# EAGLE design 311_lora (EAGLE 8.2.2)
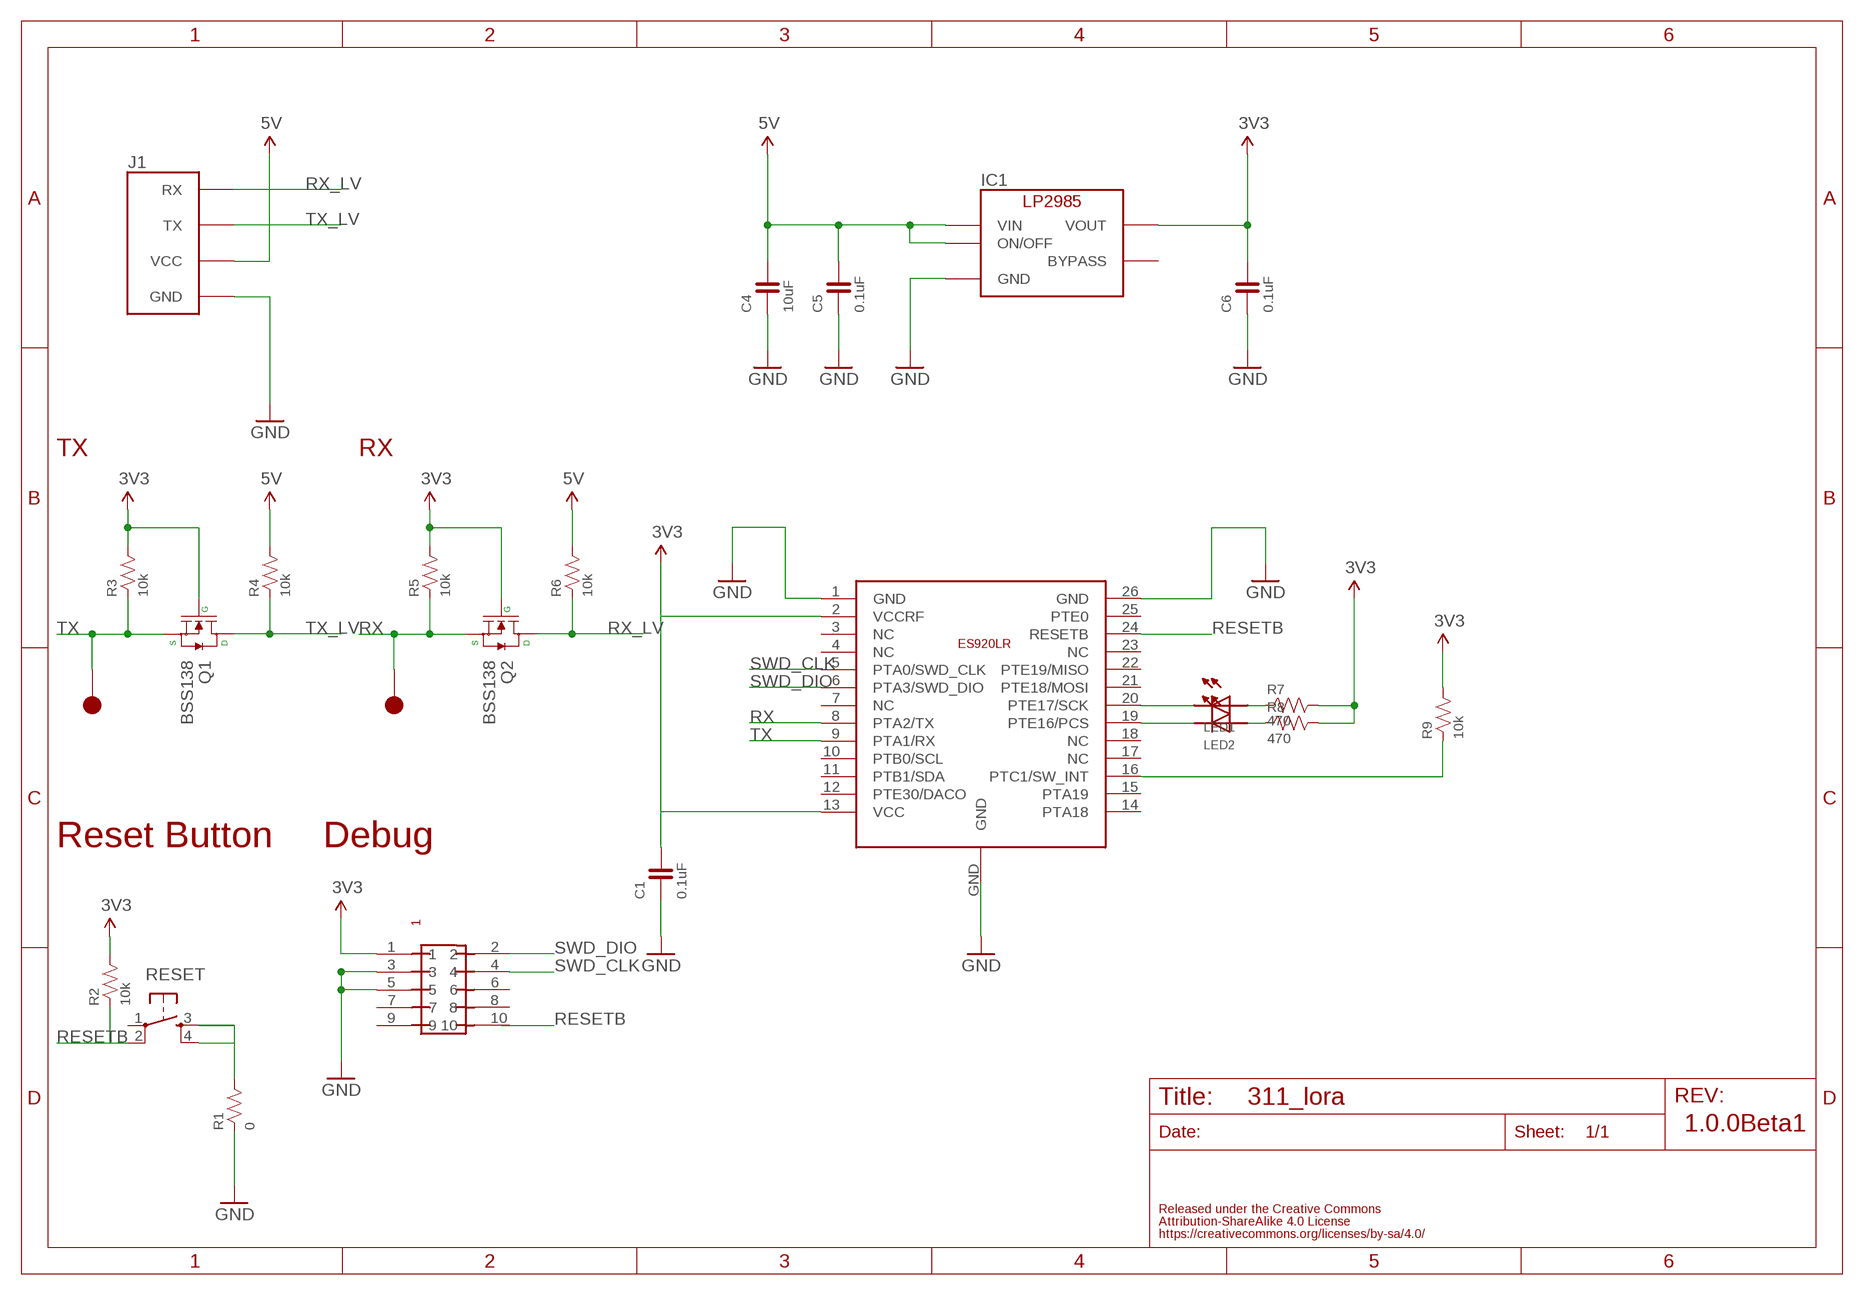
[diagram p0: schematic, sheet 1]

## Parts
C1  0.1uF  CAPACITOR-0603_NARROW  [0603-NARROW]
C4  10uF  CAPACITOR-0603_NARROW  [0603-NARROW]
C5  0.1uF  CAPACITOR-0603_NARROW  [0603-NARROW]
C6  0.1uF  CAPACITOR-0603_NARROW  [0603-NARROW]
IC1  LP2985-33DBV  [SOT-23-5]
J1  FABO_BRICK_SERIAL-LONGER  [FABO_BRICK_SERIAL_LONGER]
LED1  LED-0603  [0603]
LED2  LED-0603  [0603]
Q1  BSS138  MOSFET-N  [SOT23-3]
Q2  BSS138  MOSFET-N  [SOT23-3]
R1  0  RESISTOR-0603-NARROW  [0603-NARROW]
R2  10k  RESISTOR-0603-NARROW  [0603-NARROW]
R3  10k  RESISTOR-0603-NARROW  [0603-NARROW]
R4  10k  RESISTOR-0603-NARROW  [0603-NARROW]
R5  10k  RESISTOR-0603-NARROW  [0603-NARROW]
R6  10k  RESISTOR-0603-NARROW  [0603-NARROW]
R7  470  RESISTOR-0603-NARROW  [0603-NARROW]
R8  470  RESISTOR-0603-NARROW  [0603-NARROW]
R9  10k  RESISTOR-0603-NARROW  [0603-NARROW]
RESET  TACT-SWITCH-SMD_KMR2  [KMR2]
TP10  TP-15  [TP-15]
TP11  TP-15  [TP-15]
U$2  ES920LR  [ES920LR]
U$8  PIN-HEADER-SMT(1.27MM)2X5  [PIN-HEADER-SMT(1.27MM)2X5]

## Nets
3V3: C1.2 C6.2 IC1.5(VOUT) Q1.1(G) Q2.1(G) R2.2 R3.2 R5.2 R7.2 R8.2 R9.2 U$2.2(VCCRF) U$2.13(VCC) U$8.1
5V: C4.2 C5.2 IC1.1(VIN) IC1.3(ON/OFF) J1.VCC R4.2 R6.2
GND: C1.1 C4.1 C5.1 C6.1 IC1.2(GND) J1.GND R1.1 U$2.1(GND) U$2.26(GND) U$2.GND U$8.3 U$8.5
N$2: R1.2 RESET.3 RESET.4
N$3: LED2.CATHODE U$2.19(PTE16/PCS)
N$4: LED1.CATHODE U$2.20(PTE17/SCK)
N$5: LED1.ANODE R7.1
N$6: LED2.ANODE R8.1
N$7: R9.1 U$2.16(PTC1/SW_INT)
RESETB: R2.1 RESET.2 U$2.24(RESETB) U$8.10
RX: Q2.2(S) R5.1 TP10.1 U$2.8(PTA2/TX)
RX_LV: J1.RX Q2.3(D) R6.1
SWD_CLK: U$2.5(PTA0/SWD_CLK) U$8.4
SWD_DIO: U$2.6(PTA3/SWD_DIO) U$8.2
TX: Q1.2(S) R3.1 TP11.1 U$2.9(PTA1/RX)
TX_LV: J1.TX Q1.3(D) R4.1
Unconnected: IC1.4(BYPASS) RESET.1 U$2.3(NC) U$2.4(NC) U$2.7(NC) U$2.10(PTB0/SCL) U$2.11(PTB1/SDA) U$2.12(PTE30/DACO) U$2.14(PTA18) U$2.15(PTA19) U$2.17(NC) U$2.18(NC) U$2.21(PTE18/MOSI) U$2.22(PTE19/MISO) U$2.23(NC) U$2.25(PTE0) U$8.6 U$8.7 U$8.8 U$8.9

## Notes on the sheet
- TX | RX
- Reset Button | Debug
- 1.0.0Beta1

## Library data of the parts
C1 C4-C6 = FaBo-Capacitor:CAPACITOR: CAPACITOR
IC1 = FaBo-Supply:LP2985: LP2985
J1 = FaBo-Template:FABO_BRICK_SERIAL: FaBo Brick Serial
LED1 LED2 = FaBo-LED:LED
Q1 Q2 = FaBo-etc:MOSFET-N
R1-R9 = FaBo-Resistors:RESISTOR: RESISTOR
RESET = FaBo-Switch:TACT-SWITCH
TP10 TP11 = FaBo-Supply:TP
U$2 = FaBo-LoRa:ES920LR
U$8 = GClue:PIN-HEADER-SMT(1.27MM)2X5: PIN-HEADER-SMT (1.27MM) 2x5

## Board
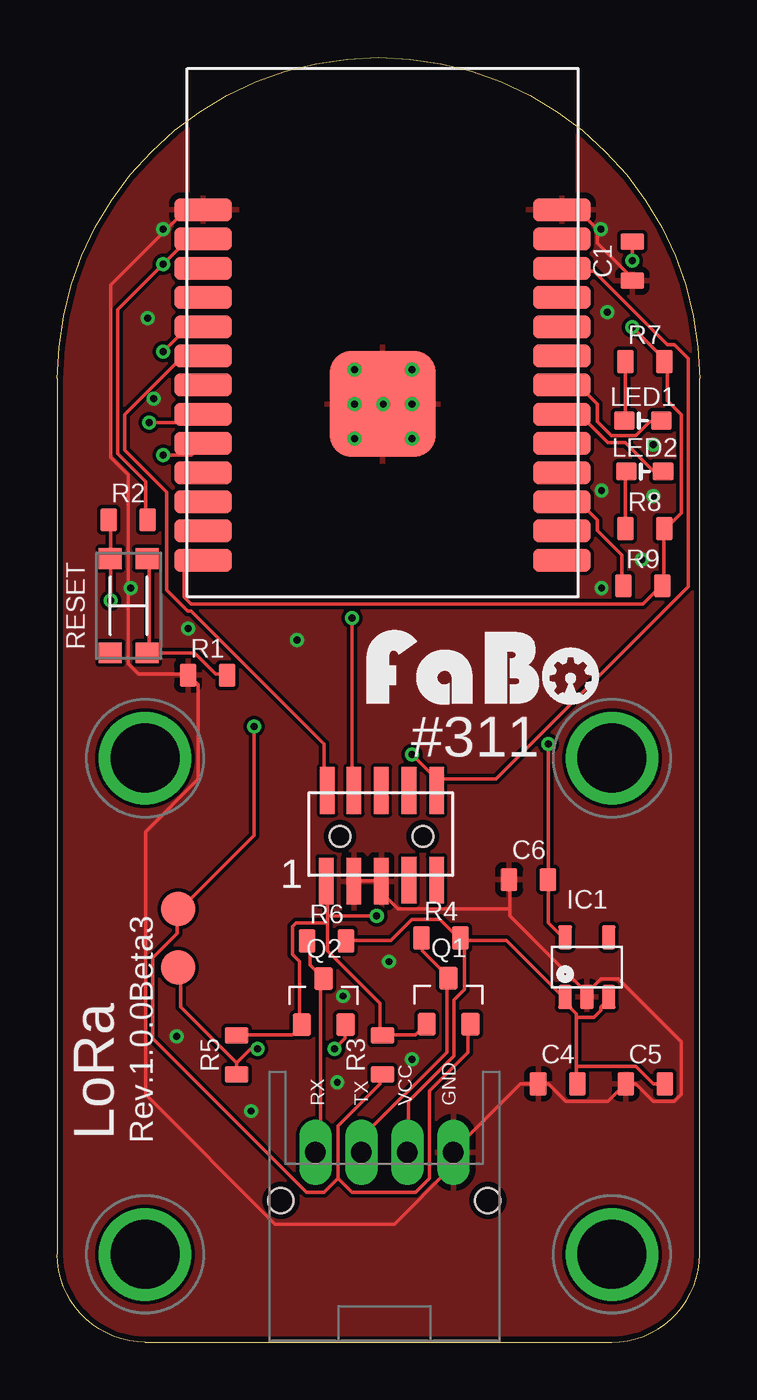
[diagram p1: board, top side]
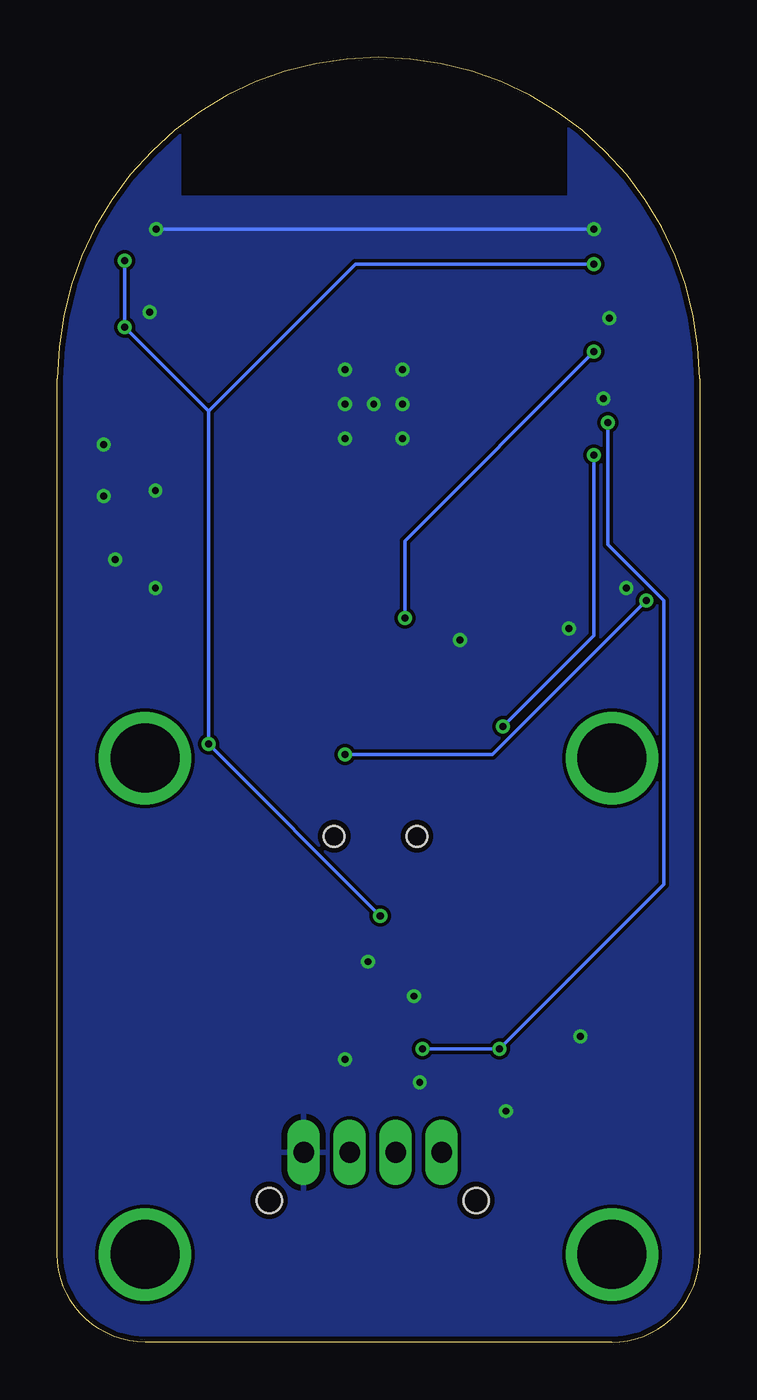
[diagram p2: board, bottom side, seen from below]

Size 27.94 x 55.88 mm. Coordinates in mm from the lower left corner, seen from the top.
Copper layers (1*16): Top 0.035mm / dielectric 1.5mm / Bottom 0.035mm
Design rules "SeeedStudio_2layer_DRU_no_angle_20140221": minimum track width 6mil, minimum drill 12mil, track to track 6mil, track to pad 6mil, pad to pad 6mil, via to via 6mil, smd to smd 0mil, copper to edge 10mil, drill to drill 10mil, minimum pad ring 10mil, minimum via ring 6mil, stop-mask expansion 2mil, vias tented up to drill 100mil, thermal gap 10mil

### Footprints (pad centres in the part's own frame; a part is rotated, then mirrored left to right if it is on the bottom)
0603-NARROW = smd 0.71 x 1: 1 -0.85,0; 2 0.85,0
SOT-23-5 = smd 0.6 x 1.05: 1 -0.95,-1.3; 2 0,-1.3; 3 0.95,-1.3; 4 0.95,1.3; 5 -0.95,1.3
FABO_BRICK_SERIAL_LONGER = drill 0.9 pad 1.422 long: GND 3.254,-17.145; RX -2.746,-17.145; TX -0.746,-17.145; VCC 1.254,-17.145 | drill 3 pad 3.81: P$5 -10.16,0; P$6 10.16,0; P$7 -10.16,-21.59; P$8 10.16,-21.59 | hole 1.1: -4.246,-19.245; 4.754,-19.245
0603 = smd 0.9 x 0.8: ANODE -0.8,0; CATHODE 0.8,0
SOT23-3 = smd 0.8 x 1: 1 -0.95,-1; 2 0.95,-1; 3 0,1
KMR2 = smd 0.9 x 1: 1 -2.05,0.8; 2 2.05,0.8; 3 2.05,-0.8; 4 -2.05,-0.8
TP-15 = smd 1.5 x 1.5: 1 0,0
ES920LR = smd 2.5 x 1: 1 -7.8,5.84; 2 -7.8,4.57; 3 -7.8,3.3; 4 -7.8,2.03; 5 -7.8,0.76; 6 -7.8,-0.51; 7 -7.8,-1.78; 8 -7.8,-3.05; 9 -7.8,-4.32; 10 -7.8,-5.59; 11 -7.8,-6.86; 12 -7.8,-8.13; 13 -7.8,-9.4; 14 7.8,-9.4; 15 7.8,-8.13; 16 7.8,-6.86; 17 7.8,-5.59; 18 7.8,-4.32; 19 7.8,-3.05; 20 7.8,-1.78; 21 7.8,-0.51; 22 7.8,0.76; 23 7.8,2.03; 24 7.8,3.3; 25 7.8,4.57; 26 7.8,5.84 | smd 4.6 x 4.6: GND 0,-2.6
PIN-HEADER-SMT(1.27MM)2X5 = smd 0.635 x 2.032: 1 -2.4,-1.95; 2 -2.35,2; 3 -1.2,-1.95; 4 -1.2,2; 5 0,-1.95; 6 0,2; 7 1.2,-1.9; 8 1.2,2; 9 2.4,-1.9; 10 2.4,2 | hole 0.9: 1.8,0; -1.8,0

### Placement (x,y rotation side)
C1  25.02,47.02 90 top
C4  21.77,11.23 0 top
C5  25.58,11.23 0 top
C6  20.5,20.12 0 top
IC1  23.04,16.31 0 top
J1  13.97,25.4 0 top
LED1  25.48,40.08 0 top
LED2  25.55,37.87 0 top
Q1  17.02,14.83 0 top
Q2  11.58,14.81 0 top
R1  6.53,29.01 0 top
R2  3.07,35.76 0 top
R3  14.15,12.5 90 top
R4  16.69,17.58 0 top
R5  7.8,12.5 90 top
R6  11.71,17.45 0 top
R7  25.55,42.65 0 top
R8  25.55,35.38 0 top
R9  25.48,32.9 0 top
RESET  3.1,32.03 90 top
TP10  5.26,16.31 0 top
TP11  5.26,18.85 0 top
U$2  14.15,43.41 0 top
U$3  [LOGO_FABO_MS]  18.52,27.36 0 top
U$8  14.1,22 0 top

### Tracks (layer width: path | path; a pad name or v marks a point on that pad's centre or on a via)
3V3  (via drill 0.3)
  Top 0.152: R2.2 3.84,35.76 3.84,37.44 2.62,38.66 2.62,44.91 v4.6,46.89 5.66,47.95 6.27,47.95 U$2.2 | R5.2 7.8,13.36 10.24,13.36 10.54,13.66 Q2.1 10.54,13.82 10.54,16.56 10.24,16.87 10.24,18.08 10.39,18.24 11.76,18.24 | Q1.1 16.03,13.82 15.57,13.36 14.2,13.36 R3.2 14.05,13.36 14.05,14.73 11.76,17.02 11.76,18.24 | 11.76,18.54 11.76,19.91 U$8.1 | 11.76,18.54 11.76,18.24 | IC1.5 21.97,17.63 21.36,18.24 21.36,20.07 C6.2 21.36,20.22 v21.36,26.01 | v25.02,47.04 C1.2 | v25.02,44.14 26.39,42.77 R7.2 26.54,42.62 26.54,40.94 27.15,40.33 27.15,36.07 26.54,35.46 R8.2 26.39,35.31 26.39,33.02 R9.2 26.24,32.87 25.48,32.11 5.82,32.11 5.51,32.41 5.51,33.48 5.97,33.93 6.27,33.93 U$2.13 | v13.89,18.54 11.76,18.54
  Bottom 0.152: v25.02,47.04 v25.02,44.14 21.36,40.49 | 21.36,40.49 v21.36,26.01 v13.89,18.54 | v4.6,46.89 14.96,46.89 21.36,40.49
5V
  Top 0.152: R6.2 12.67,17.47 14.5,17.47 15.42,18.39 16.64,18.39 17.4,17.63 R4.2 | 22.58,14.12 22.58,14.27 21.97,14.88 IC1.1 21.97,15.04 19.53,17.47 17.7,17.47 | 22.58,14.12 22.58,11.99 | 22.58,11.99 22.58,11.23 C4.2 | C5.2 25.93,11.23 25.17,11.99 22.58,11.99 | 22.58,14.12 23.34,14.12 23.65,14.43 23.65,14.58 23.95,14.88 IC1.3 | 17.7,17.47 17.55,17.47 R4.2 | 17.7,17.47 17.7,15.34 17.25,14.88 17.25,12.45 15.27,10.46 15.27,8.33 J1.VCC | 17.7,17.47 R4.2
GND  (via drill 0.3)
  Top 0.152: U$8.3 12.98,20.07 14.05,20.07 U$8.5 14.2,19.91 14.2,19.46 14.81,18.85 19.68,18.85 | 19.68,18.85 19.68,18.54 23.04,15.19 | 19.68,18.85 19.68,20.07 C6.1 | 23.04,15.19 IC1.2 23.04,15.04 | 23.04,15.19 23.65,15.8 24.41,15.8 27.15,13.06 27.15,10.77 26.85,10.46 25.93,10.46 25.17,11.23 C5.1 24.71,11.23 23.95,10.46 22.12,10.46 21.36,11.23 C4.1 20.14,11.23 17.25,8.33 J1.GND 17.09,8.18 17.09,7.57 14.66,5.13 9.47,5.13 3.84,10.77 3.84,22.2 6.12,24.49 6.12,28.6 5.82,28.9 R1.1 5.66,29.06 3.53,29.06 3.07,29.51 3.07,37.74 2.31,38.51 2.31,45.97 4.75,48.41 | 23.49,48.41 23.49,47.8 25.02,46.28 C1.1 | 23.49,48.41 22.73,49.17 21.97,49.17 U$2.26 | 4.75,48.41 5.51,49.17 6.27,49.17 U$2.1 | v23.65,48.41 23.49,48.41 | 4.75,48.41 v4.6,48.41
  Bottom 0.152: v4.6,48.41 v23.65,48.41
  other vias: 12.93,42.3 15.43,42.3 12.93,40.8 14.18,40.8 15.43,40.8 15.43,39.3 12.93,39.3 23.93,44.8 3.93,44.55 4.18,41.05 10.43,30.55 5.68,31.05 14.43,16.55 5.18,13.3 8.43,10.05 12.18,11.3 12.43,15.05 15.43,12.3 23.68,37.05 23.68,32.8 25.93,36.8 25.43,34.05 3.18,32.8 25.93,39.05
  pour Bottom: 0.18,-0.2 28.18,-0.2 28.18,56.8 0.18,56.8
  pour Top: 0.18,-0.2 28.18,-0.2 28.18,56.8 0.18,56.8
N$2
  Top 0.152: R1.2 7.34,29.06 6.88,29.06 5.97,29.97 3.99,29.97 RESET.4 3.99,30.12 3.99,33.93 RESET.3
N$3
  Top 0.152: LED2.CATHODE 26.24,37.9 25.93,37.9 24.71,39.12 23.95,39.12 22.73,40.33 21.97,40.33 U$2.19
N$4
  Top 0.152: LED1.CATHODE 26.24,40.03 25.78,40.03 25.17,39.42 24.1,39.42 23.49,40.03 23.49,40.79 22.73,41.55 21.97,41.55 U$2.20
N$5
  Top 0.152: LED1.ANODE 24.71,40.18 24.71,42.62 R7.1
N$6
  Top 0.152: LED2.ANODE 24.71,37.74 24.71,35.46 R8.1
N$7
  Top 0.152: R9.1 24.56,33.02 24.56,34.24 23.49,35.31 23.49,35.76 22.73,36.52 21.97,36.52 U$2.16
RESETB  (via drill 0.3)
  Top 0.152: R2.1 2.31,35.76 2.31,34.09 RESET.2 2.31,33.93 v2.31,32.26 | 16.48,24.49 v15.42,25.55 | 16.48,24.49 16.48,24.03 U$8.10 16.48,24.49 | 16.48,24.49 19.08,24.49 27.46,32.87 27.46,42.77 26.85,43.38 26.54,43.38 23.34,46.58 21.97,46.58 U$2.24
  Bottom 0.152: v2.31,32.26 9.02,25.55 v15.42,25.55
RX  (via drill 0.3)
  Top 0.152: 7.8,12.14 R5.1 | 7.8,12.14 5.36,14.58 5.36,16.26 TP10.1 | v12.06,12.75 12.52,13.21 12.52,13.66 Q2.2 | v8.71,12.75 8.41,12.75 7.8,12.14 | v3.99,40.01 6,40.01 U$2.8
  Bottom 0.152: v12.06,12.75 v8.71,12.75 1.55,19.91 1.55,32.26 3.99,34.7 v3.99,40.01
RX_LV
  Top 0.152: R6.1 11,17.32 11,16.41 11.46,15.95 Q2.3 11.46,15.8 11.46,8.48 11.3,8.33 J1.RX
SWD_CLK  (via drill 0.3)
  Top 0.152: v12.83,31.5 12.83,24.03 U$8.4 | v4.6,43.08 5.66,44.14 6.27,44.14 U$2.5
  Bottom 0.152: v12.83,31.5 12.83,34.85 v4.6,43.08
SWD_DIO
  Top 0.152: U$8.2 11.61,24.03 11.61,26.01 5.82,31.8 5.66,31.8 4.75,32.71 4.75,36.98 2.92,38.81 2.92,40.33 5.36,42.77 6.27,42.77 U$2.6
TX  (via drill 0.3)
  Top 0.152: 12.22,7.11 12.22,9.4 14.05,11.23 14.05,11.53 R3.1 | 12.22,7.11 12.83,6.5 15.57,6.5 16.18,7.11 16.18,10.92 17.86,12.6 17.86,13.82 Q1.2 | 12.22,7.11 11.61,6.5 10.85,6.5 4.14,13.21 4.14,16.71 5.21,17.78 5.21,18.85 TP11.1 5.36,18.85 8.56,22.05 v8.56,26.77 | v4.6,38.57 5.83,38.57 U$2.9
  Bottom 0.152: v4.6,38.57 4.6,30.73 v8.56,26.77
TX_LV
  Top 0.152: R4.1 15.87,17.47 15.87,17.02 16.94,15.95 Q1.3 16.94,15.8 16.94,12.6 13.28,8.94 13.28,8.33 J1.TX

### Text on the board
tPlace: #311 | LoRa | Rev.1.0.0Beta3